# EAGLE design belamini_cape_B4 (EAGLE 9.6.0)

## Sheet 1 of 2
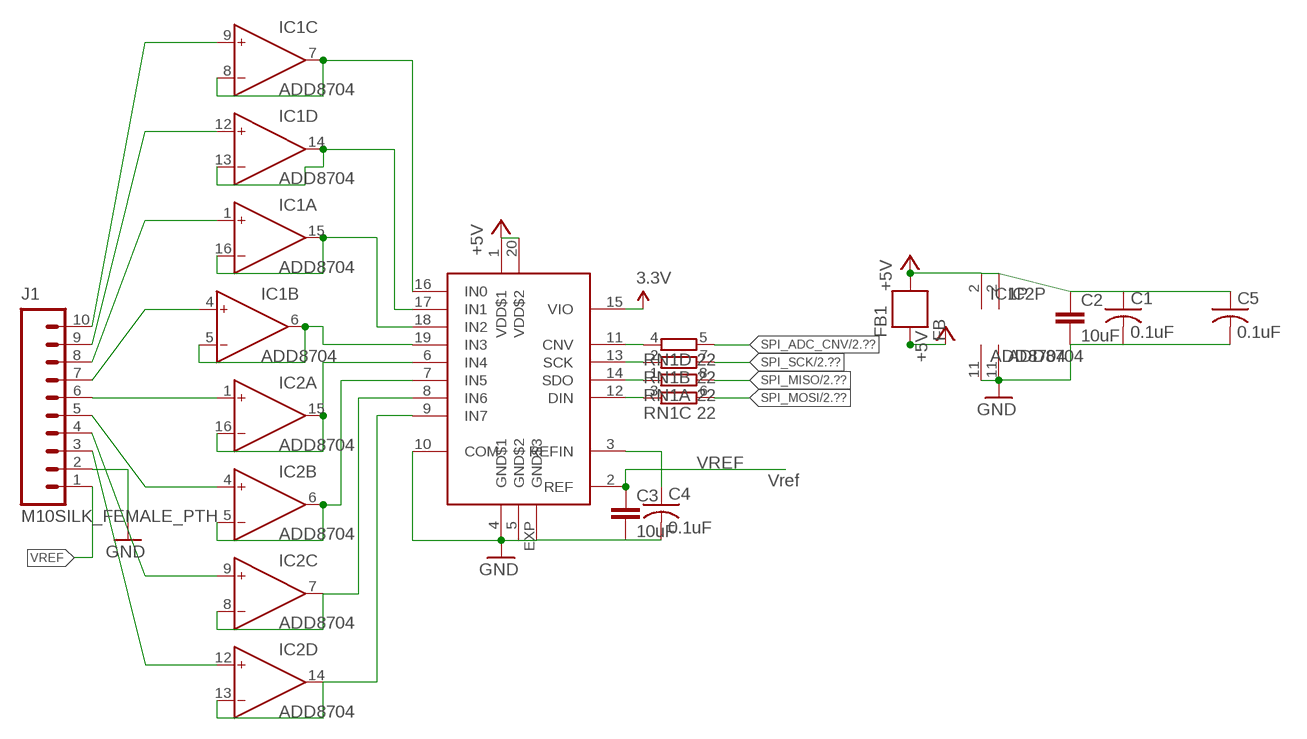
[diagram p0: schematic, sheet 1]

### Parts
C1  0.1uF  C-USC0603  [C0603]
C2  10uF  CAP0603-CAP  [0603-CAP]
C3  10uF  CAP0603-CAP  [0603-CAP]
C4  0.1uF  C-USC0603  [C0603]
C5  0.1uF  C-USC0603  [C0603]
FB1  FB  [0603]
IC1  ADD8704  [QFN16-3X3]
IC2  ADD8704  [QFN16-3X3]
IC3  AD7699  [LFCSP20-LEADS]
J1  M10SILK_FEMALE_PTH  [1X10]
RN1  22  4R-N0603-ARC  [0603-ARC]

### Nets
3.3V: IC3.15(VIO) ; also sheet 2
+5V_ADC_DAC: C1.1 C2.1 C5.1 FB1.1 IC1.2(P:V+) IC2.2(P:V+) IC3.1(VDD$1) IC3.20(VDD$2) ; supply symbol labelled +5V
+5V_SYS: FB1.2 ; supply symbol labelled +5V ; also sheet 2
GND: C1.2 C2.2 C3.2 C4.2 C5.2 IC1.11(P:V-) IC2.11(P:V-) IC3.4(GND$1) IC3.5(GND$2) IC3.10(COM) IC3.EXP(GND$3) J1.2 ; also sheet 2
N$4: IC2.1(A:IN+) J1.6
N$7: IC1.7(C:OUT) IC1.8(C:IN-) IC3.16(IN0)
N$8: IC1.13(D:IN-) IC1.14(D:OUT) IC3.17(IN1)
N$9: IC2.15(A:OUT) IC2.16(A:IN-) IC3.6(IN4)
N$10: IC2.5(B:IN-) IC2.6(B:OUT) IC3.7(IN5)
N$11: IC2.7(C:OUT) IC2.8(C:IN-) IC3.8(IN6)
N$12: IC2.13(D:IN-) IC2.14(D:OUT) IC3.9(IN7)
N$14: IC3.11(CNV) RN1.4
N$20: IC3.12(DIN) RN1.3
N$22: C4.1 IC3.3(REFIN)
N$23: IC3.13(SCK) RN1.2
N$24: IC3.14(SDO) RN1.1
N$27: IC1.5(B:IN-) IC1.6(B:OUT) IC3.19(IN3)
N$30: IC1.15(A:OUT) IC1.16(A:IN-) IC3.18(IN2)
N$37: IC1.9(C:IN+) J1.10
N$38: IC1.12(D:IN+) J1.9
N$39: IC1.1(A:IN+) J1.8
N$40: IC1.4(B:IN+) J1.7
N$42: IC2.4(B:IN+) J1.5
N$43: IC2.9(C:IN+) J1.4
N$44: IC2.12(D:IN+) J1.3
SPI_ADC_CNV: RN1.5 ; also sheet 2
SPI_MISO: RN1.8 ; also sheet 2
SPI_MOSI: RN1.6 ; also sheet 2
SPI_SCK: RN1.7 ; also sheet 2
VREF: C3.1 IC3.2(REF) J1.1

### Notes on the sheet
- Vref

## Sheet 2 of 2
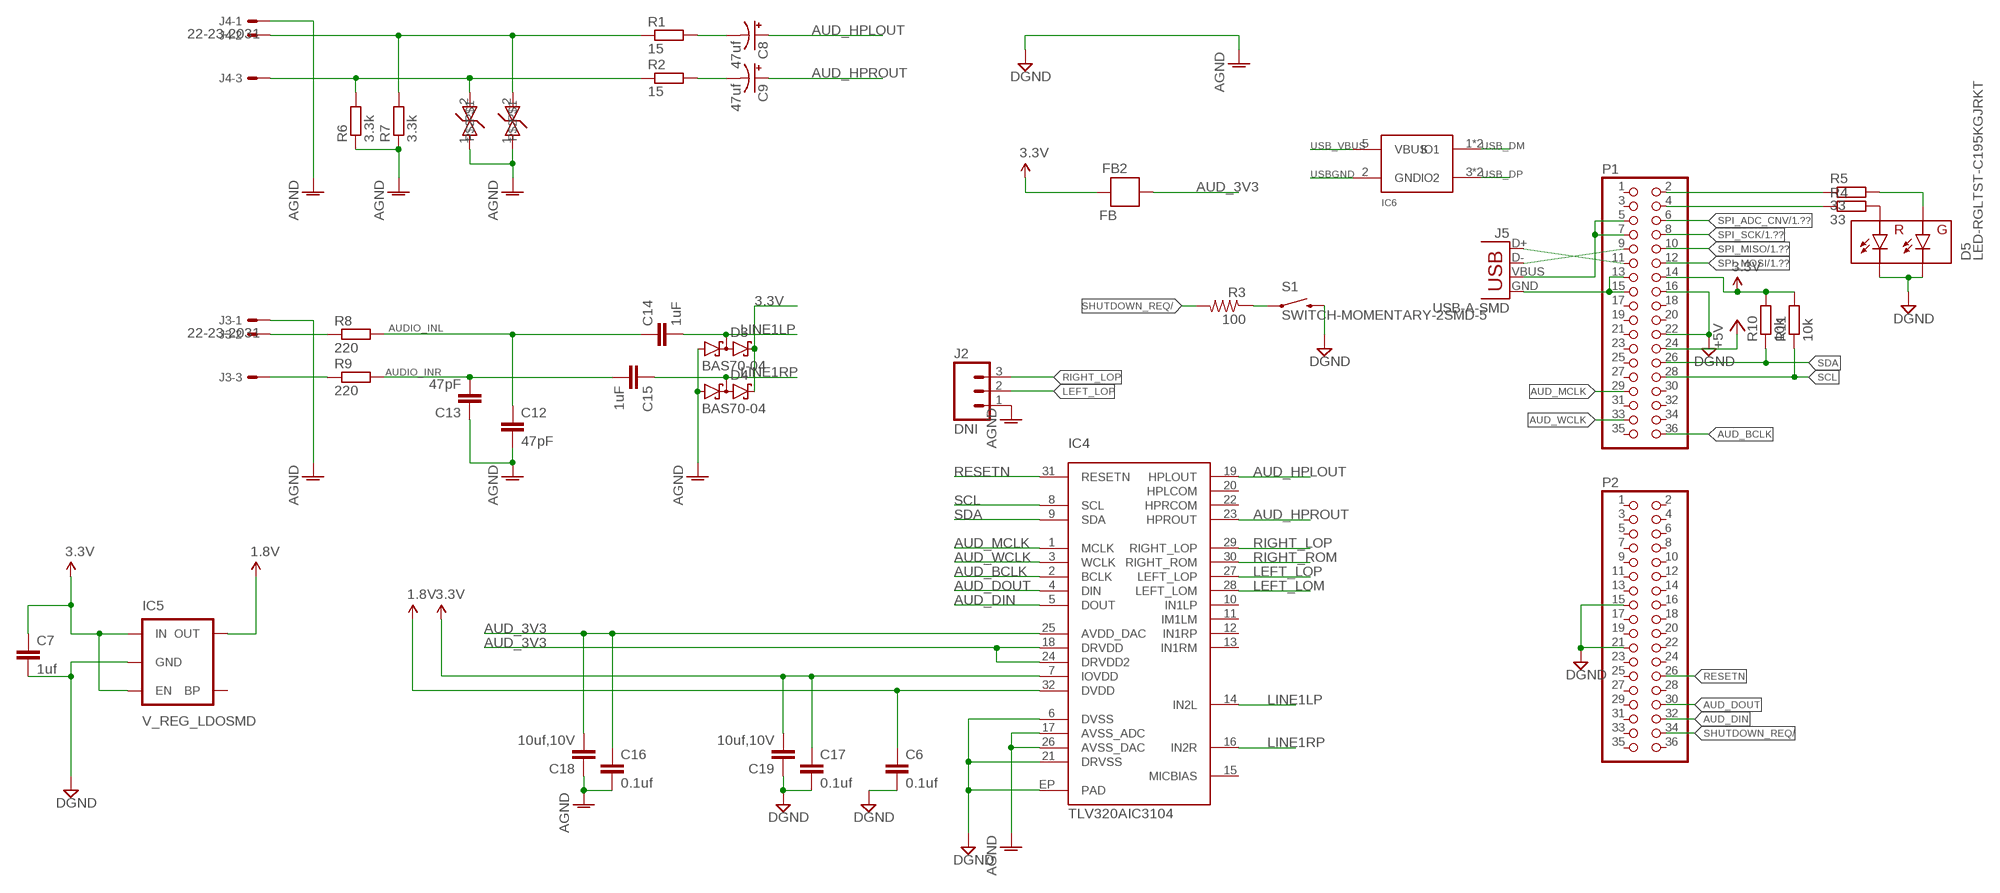
[diagram p1: schematic, sheet 2]

### Parts
C6  0.1uf  C-EUC0603  [C0603]
C7  1uf  C-EUC0603  [C0603]
C8  47uf  CAP_POL1206  [EIA3216]
C9  47uf  CAP_POL1206  [EIA3216]
C12  47pF  C-EUC0603  [C0603]
C13  47pF  C-EUC0603  [C0603]
C14  1uF  C-EUC0603  [C0603]
C15  1uF  C-EUC0603  [C0603]
C16  0.1uf  C-EUC0603  [C0603]
C17  0.1uf  C-EUC0603  [C0603]
C18  10uf,10V  CAP0603-CAP  [0603-CAP]
C19  10uf,10V  CAP0603-CAP  [0603-CAP]
D1  PGB0010603MR  [0603]
D2  PGB0010603MR  [0603]
D3  BAS70-04  [SOT23]
D4  BAS70-04  [SOT23]
D5  LED-RGLTST-C195KGJRKT  [LTST-C195KGJRKT]
FB2  FB  [0603]
IC4  TLV320AIC3104  [QFN-32]
IC5  V_REG_LDOSMD  [SOT23-5]
IC6  USBLC6-2  [SOT23-6]
J2  DNI  M03PTH  [1X03]
J3  22-23-2031  [22-23-2031]
J4  22-23-2031  [22-23-2031]
J5  USB-A-SMD  [USB-A-S-NOSILK-FEMALE]
P1  PINHD-2X18  [2X18]
P2  PINHD-2X18  [2X18]
R1  15  R-EU_R0603  [R0603]
R2  15  R-EU_R0603  [R0603]
R3  100  R-US_R0603  [R0603]
R4  33  R-EU_R0603  [R0603]
R5  33  R-EU_R0603  [R0603]
R6  3.3k  R-EU_R0603  [R0603]
R7  3.3k  R-EU_R0603  [R0603]
R8  220  R-EU_R0603  [R0603]
R9  220  R-EU_R0603  [R0603]
R10  10k  R-EU_R0603  [R0603]
R11  10k  R-EU_R0603  [R0603]
S1  SWITCH-MOMENTARY-2SMD-5  [TACTILE_SWITCH_SMD-4]

### Nets
1.8V: C6.1 IC4.32(DVDD) IC5.5(OUT)
3.3V: C7.1 C17.1 C19.2 D3.2(C2) D4.2(C2) FB2.2 IC4.7(IOVDD) IC5.1(IN) IC5.3(EN) P1.14 R10.2 R11.2 ; also sheet 1
+5V_SYS: P1.24 ; supply symbol labelled +5V ; also sheet 1
AUD_3V3: C16.1 C18.2 FB2.1 IC4.18(DRVDD) IC4.24(DRVDD2) IC4.25(AVDD_DAC)
AUD_BCLK: IC4.2(BCLK) P1.36
AUD_DIN: IC4.5(DOUT) P2.32
AUD_DOUT: IC4.4(DIN) P2.30
AUD_HPLOUT: C8.A(+) IC4.19(HPLOUT)
AUD_HPROUT: C9.A(+) IC4.23(HPROUT)
AUD_MCLK: IC4.1(MCLK) P1.29
AUD_WCLK: IC4.3(WCLK) P1.33
AUDIO_INL: C12.1 C14.1 R8.2
AUDIO_INR: C13.2 C15.2 R9.2
GND: C6.2 C7.2 C12.2 C13.1 C16.2 C17.2 C18.1 C19.1 D1.1 D2.1 D3.1(A1) D4.1(A1) D5.P$3(GC) D5.P$4(RC) IC4.6(DVSS) IC4.17(AVSS_ADC) IC4.21(DRVSS) IC4.26(AVSS_DAC) IC4.EP(PAD) IC5.2(GND) J2.1 J3.1 J4.1 P1.16 P1.22 P2.15 P2.21 R6.1 R7.1 S1.4 ; supply symbol labelled DGND, AGND ; also sheet 1
HPL: D2.2 J4.2 R1.1 R7.2
HPR: D1.2 J4.3 R2.1 R6.2
LEFT_LOM: IC4.28(LEFT_LOM)
LEFT_LOP: IC4.27(LEFT_LOP) J2.2
LINE1LP: C14.2 D3.3(C1A2) IC4.14(IN2L)
LINE1RP: C15.1 D4.3(C1A2) IC4.16(IN2R)
N$1: J3.2 R8.1
N$2: J3.3 R9.1
N$6: D5.P$2(RA) R4.2
N$13: D5.P$1(GA) R5.2
N$15: P1.4 R4.1
N$16: P1.2 R5.1
N$54: C8.C(-) R1.2
N$58: R3.1 S1.1
N$59: C9.C(-) R2.2
RESETN: IC4.31(RESETN) P2.26
RIGHT_LOP: IC4.29(RIGHT_LOP) J2.3
RIGHT_ROM: IC4.30(RIGHT_ROM)
SCL: IC4.8(SCL) P1.28 R11.1
SDA: IC4.9(SDA) P1.26 R10.1
SHUTDOWN_REQ/: P2.34 R3.2
SPI_ADC_CNV: P1.6 ; also sheet 1
SPI_MISO: P1.10 ; also sheet 1
SPI_MOSI: P1.12 ; also sheet 1
SPI_SCK: P1.8 ; also sheet 1
USB_DM: IC6.1(IO1) IC6.6(IO1) J5.D- P1.9
USB_DP: IC6.3(IO2) IC6.4(IO2) J5.D+ P1.11
USB_VBUS: IC6.5(VBUS) J5.VBUS P1.5 P1.7
USBGND: IC6.2(GND) J5.GND P1.13 P1.15
Unconnected: IC4.10(IN1LP) IC4.11(IM1LM) IC4.12(IN1RP) IC4.13(IN1RM) IC4.15(MICBIAS) IC4.20(HPLCOM) IC4.22(HPRCOM) IC5.4(BP) P1.1 P1.3 P1.17 P1.18 P1.19 P1.20 P1.21 P1.23 P1.25 P1.27 P1.30 P1.31 P1.32 P1.34 P1.35 P2.1 P2.2 P2.3 P2.4 P2.5 P2.6 P2.7 P2.8 P2.9 P2.10 P2.11 P2.12 P2.13 P2.14 P2.16 P2.17 P2.18 P2.19 P2.20 P2.22 P2.23 P2.24 P2.25 P2.27 P2.28 P2.29 P2.31 P2.33 P2.35 P2.36

### Notes on the sheet
- IC6

## Library data of the parts
C1 C4 C5 = rcl:C-US: CAPACITOR, American symbol
C2 C3 = SparkFun-Passives:CAP: Capacitor Standard 0603 ceramic capacitor, and 0.1" leaded capacitor.
C6 C16 C17 = rcl:C-EU: CAPACITOR, European symbol; MANEX: 123-0001056
C7 = rcl:C-EU: CAPACITOR, European symbol; MANEX: 123-0001087
C8 C9 = SparkFun-Capacitors:CAP_POL: Capacitor Polarized These are standard SMD and PTH capacitors. Normally 10uF, 47uF, and 100uF in electrolytic and tantalum varieties. Always verify the external diameter of the through hole cap, it varies with capacity, voltage, and manufacturer. The EIA devices should be standard.; MANEX: 123-0001196
C12 C13 = rcl:C-EU: CAPACITOR, European symbol; MANEX: 123-0001115
C14 C15 = rcl:C-EU: CAPACITOR, European symbol; MANEX: 123-0001032
C18 C19 = SparkFun-Passives:CAP: Capacitor Standard 0603 ceramic capacitor, and 0.1" leaded capacitor.; MANEX: 123-0001127
D1 D2 = CircuitCo:PGB0010603MR; MANEX: 130-0001371
D3 D4 = diode:BAS70-04: Silicon Schottky Diodes General-purpose diode for high-speed switching
D5 = SparkFun-LED:LED-RG; PROD_ID: DIO-12140
FB1 = SparkFun-Passives:FB
FB2 = SparkFun-Passives:FB; MANEX: 126-0001418
IC1 IC2 = custom:ADD8704: 16 V Quad Operational Amplifier Source: Ananlog Devices .. 780914713ADD8704_0.pdf
IC3 = custom:AD7699
IC4 = CircuitCo:TLV320AIC3104; MANEX: 140-0004277
IC5 = SparkFun-PowerIC:V_REG_LDO: Voltage Regulator LDO Standard 150mA LDO voltage regulator in SOT-23 layout. Micrel part MIC5205. BP (by-pass) pin is used to lower output noise with 470pF cap.; MANEX: 140-0001616
IC6 = custom:USBLC6-2
J1 = SparkFun-Connectors:M10: Header 10 Standard 10-pin 0.1" header. Use with straight break away headers (SKU : PRT-00116), right angle break away headers (PRT-00553), swiss pins (PRT-00743), machine pins (PRT-00117), and female headers (PRT-00115).; PROD_ID: CONN-11563
J2 = SparkFun-Connectors:M03: Header 3 Standard 3-pin 0.1" header. Use with straight break away headers (SKU : PRT-00116), right angle break away headers (PRT-00553), swiss pins (PRT-00743), machine pins (PRT-00117), and female headers (PRT-00115). Molex polarized connector foot print use with SKU : PRT-08232 with associated crimp pins and housings.
J3 J4 = con-molex:22-23-2031: .100" (2.54mm) Center Header - 3 Pin; MF: MOLEX; MPN: 22-23-2031; OC_FARNELL: 1462950; OC_NEWARK: 30C0862
J5 = SparkFun-Connectors:USB: USB Connectors USB-B-PTH is fully proven SKU : PRT-00139/CONN-08278 USB-miniB is fully proven SKU : PRT-00587 USB-A-PCB is untested. USB-A-H is throughly reviewed, but untested. Spark Fun Electronics SKU : PRT-00437 USB-B-SMT is throughly reviewed, but untested. Needs silkscreen touching up. USB-A-S has not been used/tested USB-MB-H has not been used/tested USB-MICROB has been used. CONN-09505; PROD_ID: CONN-09520
P1 P2 = pinhead:PINHD-2X18: PIN HEADER
R1 R2 R4-R11 = rcl:R-EU_: RESISTOR, European symbol; MANEX: 110-0002014
R3 = rcl:R-US_: RESISTOR, American symbol
RN1 = resistor-dil:4R-N: Array Chip Resistor Source: RS Component / Phycomp; OC_FARNELL: unknown; OC_NEWARK: unknown
S1 = custom:SWITCH-MOMENTARY-2: Various NO switches- pushbuttons, reed, etc

## Board
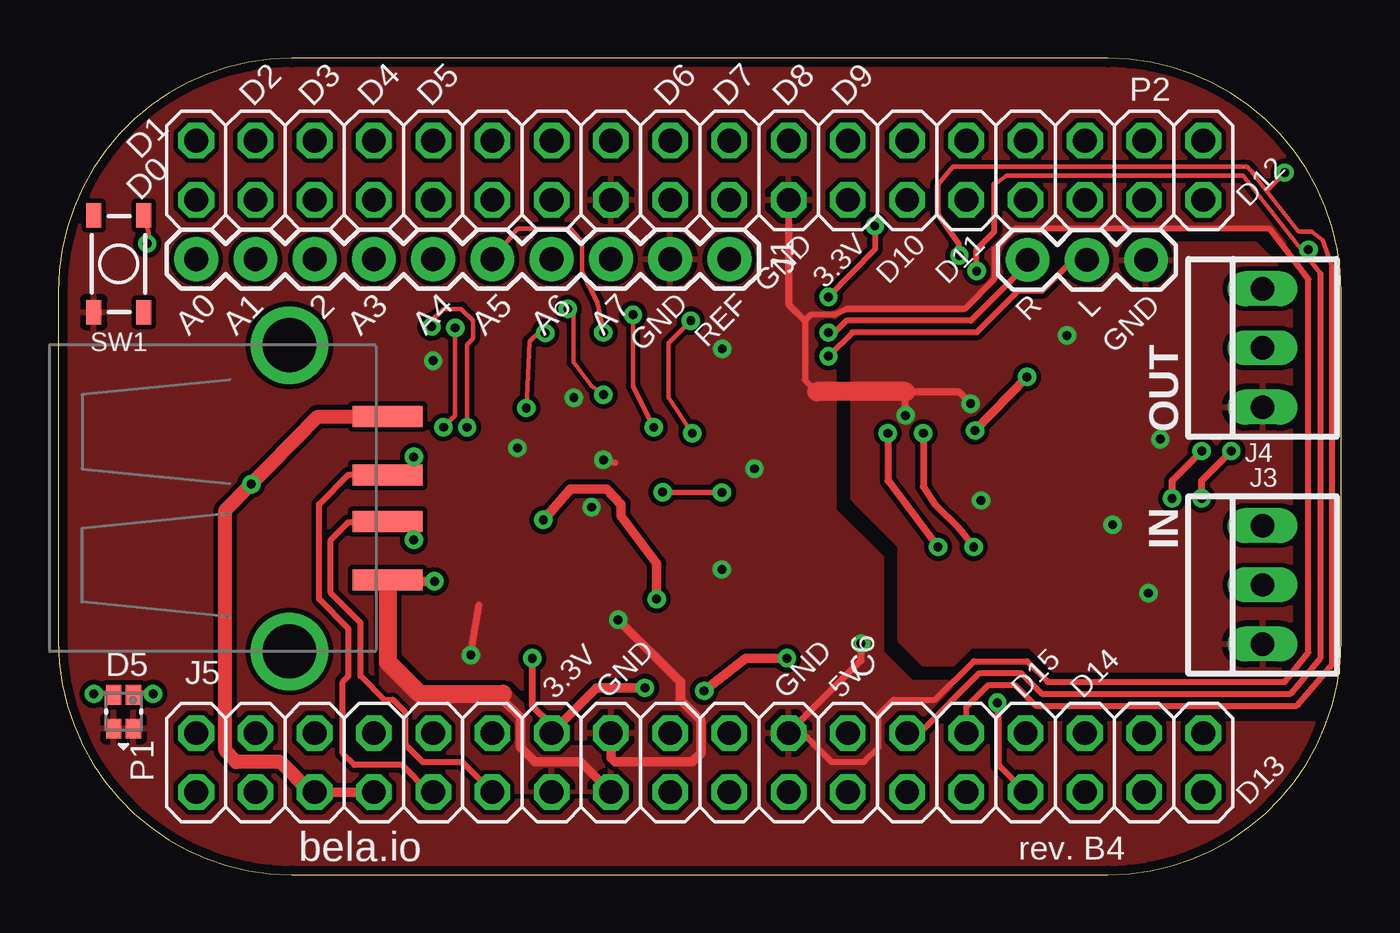
[diagram p2: board, top side]
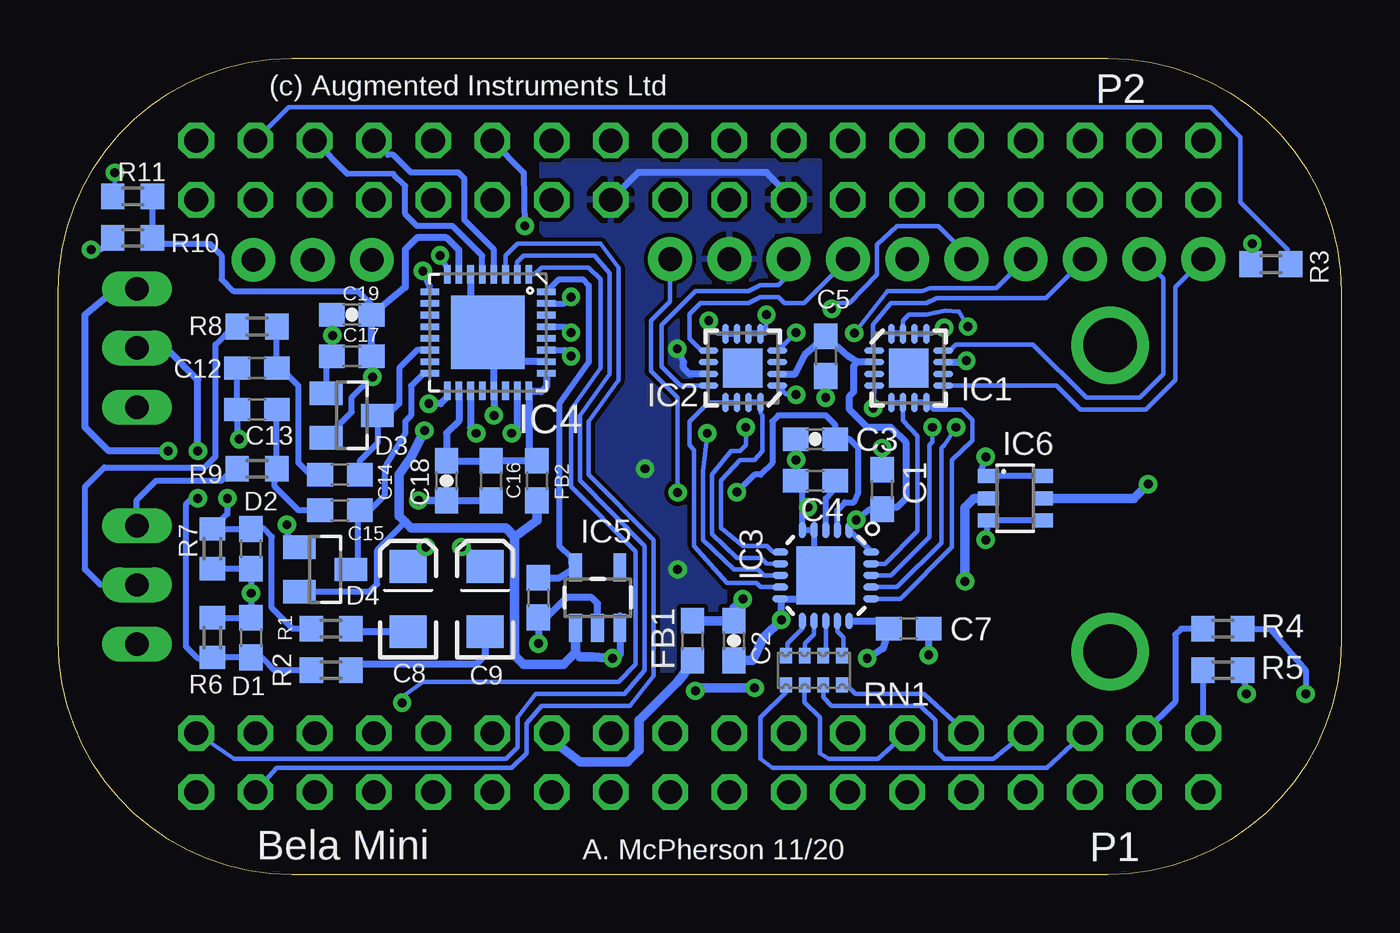
[diagram p3: board, bottom side, seen from below]

Size 55 x 35 mm. Coordinates in mm from the lower left corner, seen from the top.
Outline: 45,35 10,35 arc90 0,25 0,10 arc90 10,0 45,0 arc90 55,10 55,25 arc90 45,35
Copper layers (1*16): Top 0.035mm / dielectric 1.5mm / Bottom 0.035mm
Design rules "default *": minimum track width 8mil, minimum drill 15mil, track to track 7mil, track to pad 7mil, pad to pad 7mil, via to via 7mil, smd to smd 0mil, copper to edge 15mil, drill to drill 8mil, minimum pad ring 10mil, minimum via ring 8mil, stop-mask expansion 4mil, vias tented up to drill 20mil, thermal gap 10mil

### Footprints (pad centres in the part's own frame; a part is rotated, then mirrored left to right if it is on the bottom)
C0603 = smd 1.1 x 1: 1 -0.85,0; 2 0.85,0
0603-CAP = smd 1.1 x 1: 1 -0.85,0; 2 0.85,0
EIA3216 = smd 1.4 x 1.6: A 1.4,0; C -1.4,0
0603 = smd 1.1 x 1: 1 -0.85,0; 2 0.85,0
SOT23 = smd 1 x 1.4: 1 -0.95,-1.1; 2 0.95,-1.1; 3 0,1.1
LTST-C195KGJRKT = smd 0.65 x 0.85: P$1 0.425,0.725; P$2 -0.425,0.725; P$3 0.425,-0.725; P$4 -0.425,-0.725
QFN16-3X3 = smd 0.85 x 0.28: 1 -1.475,0.75; 2 -1.475,0.25; 3 -1.475,-0.25; 4 -1.475,-0.75; 9 1.475,-0.75; 10 1.475,-0.25; 11 1.475,0.25; 12 1.475,0.75 | smd 0.28 x 0.85: 5 -0.75,-1.475; 6 -0.25,-1.475; 7 0.25,-1.475; 8 0.75,-1.475; 13 0.75,1.475; 14 0.25,1.475; 15 -0.25,1.475; 16 -0.75,1.475 | smd 1.68 x 1.68: EXT 0,0
LFCSP20-LEADS = smd 0.7 x 0.3: 1 -1.95,1; 2 -1.95,0.5; 3 -1.95,0; 4 -1.95,-0.5; 5 -1.95,-1; 11 1.95,-1; 12 1.95,-0.5; 13 1.95,0; 14 1.95,0.5; 15 1.95,1 | smd 0.3 x 0.7: 6 -1,-1.95; 7 -0.5,-1.95; 8 0,-1.95; 9 0.5,-1.95; 10 1,-1.95; 16 1,1.95; 17 0.5,1.95; 18 0,1.95; 19 -0.5,1.95; 20 -1,1.95 | smd 2.5 x 2.5: EXP 0,0
QFN-32 = smd 0.285 x 0.8: 1 -1.75,-2.5; 2 -1.25,-2.5; 3 -0.75,-2.5; 4 -0.25,-2.5; 5 0.25,-2.5; 6 0.75,-2.5; 7 1.25,-2.5; 8 1.75,-2.5; 17 1.75,2.5; 18 1.25,2.5; 19 0.75,2.5; 20 0.25,2.5; 21 -0.25,2.5; 22 -0.75,2.5; 23 -1.25,2.5; 24 -1.75,2.5 | smd 0.8 x 0.285: 9 2.5,-1.75; 10 2.5,-1.25; 11 2.5,-0.75; 12 2.5,-0.25; 13 2.5,0.25; 14 2.5,0.75; 15 2.5,1.25; 16 2.5,1.75; 25 -2.5,1.75; 26 -2.5,1.25; 27 -2.5,0.75; 28 -2.5,0.25; 29 -2.5,-0.25; 30 -2.5,-0.75; 31 -2.5,-1.25; 32 -2.5,-1.75 | smd 3.15 x 3.15: EP 0,0
SOT23-5 = smd 0.55 x 1.2: 1 -0.95,-1.3; 2 0,-1.3; 3 0.95,-1.3; 4 0.95,1.3; 5 -0.95,1.3
SOT23-6 = smd 0.6 x 0.9: 1 -0.95,-1.15; 2 0,-1.15; 3 0.95,-1.15; 4 0.95,1.15; 5 0,1.15; 6 -0.95,1.15
1X10 = drill 1.016 pad 1.88: 1 0,0; 2 2.54,0; 3 5.08,0; 4 7.62,0; 5 10.16,0; 6 12.7,0; 7 15.24,0; 8 17.78,0; 9 20.32,0; 10 22.86,0
1X03 = drill 1.016 pad 1.88: 1 0,0; 2 2.54,0; 3 5.08,0
22-23-2031 = drill 1 long: 1 -2.54,0; 2 0,0; 3 2.54,0
USB-A-S-NOSILK-FEMALE = smd 3 x 0.9: D+ 4.212,-1; D- 4.212,1; GND 4.212,-3.5; VBUS 4.212,3.5 | drill 2.311: S1 0,-6.566; S2 0,6.566
2X18 = drill 1.016 octagon: 1 -21.59,-1.27; 2 -21.59,1.27; 3 -19.05,-1.27; 4 -19.05,1.27; 5 -16.51,-1.27; 6 -16.51,1.27; 7 -13.97,-1.27; 8 -13.97,1.27; 9 -11.43,-1.27; 10 -11.43,1.27; 11 -8.89,-1.27; 12 -8.89,1.27; 13 -6.35,-1.27; 14 -6.35,1.27; 15 -3.81,-1.27; 16 -3.81,1.27; 17 -1.27,-1.27; 18 -1.27,1.27; 19 1.27,-1.27; 20 1.27,1.27; 21 3.81,-1.27; 22 3.81,1.27; 23 6.35,-1.27; 24 6.35,1.27; 25 8.89,-1.27; 26 8.89,1.27; 27 11.43,-1.27; 28 11.43,1.27; 29 13.97,-1.27; 30 13.97,1.27; 31 16.51,-1.27; 32 16.51,1.27; 33 19.05,-1.27; 34 19.05,1.27; 35 21.59,-1.27; 36 21.59,1.27
R0603 = smd 1 x 1.1: 1 -0.85,0; 2 0.85,0
0603-ARC = smd 0.5 x 0.65: 1 -1.2,-0.625; 2 -0.4,-0.625; 3 0.4,-0.625; 4 1.2,-0.625; 5 1.2,0.625; 6 0.4,0.625; 7 -0.4,0.625; 8 -1.2,0.625
TACTILE_SWITCH_SMD-4 = smd 1.05 x 0.65: 1 -2.075,1.075; 2 2.075,1.075; 3 -2.075,-1.075; 4 2.075,-1.075

### Placement (x,y rotation side)
C1  19.69,16.51 90 bottom
C2  26.04,10.03 270 bottom
C3  22.54,18.67 180 bottom
C4  22.54,16.89 180 bottom
C5  22.1,22.22 270 bottom
C6  34.42,11.87 270 bottom
C7  18.54,10.54 0 bottom
C8  40.01,11.81 90 bottom
C9  36.7,11.81 90 bottom
C12  46.48,21.72 180 bottom
C13  46.48,19.94 0 bottom
C14  42.93,17.14 0 bottom
C15  42.93,15.62 180 bottom
C16  36.45,16.89 270 bottom
C17  42.42,22.22 180 bottom
C18  38.35,16.89 90 bottom
C19  42.42,24 0 bottom
D1  46.74,10.16 270 bottom
D2  46.74,13.97 90 bottom
D3  42.42,19.68 270 bottom
D4  43.56,13.08 270 bottom
D5  2.79,6.99 0 top
FB1  27.81,10.03 270 bottom
FB2  34.48,16.89 270 bottom
IC1  18.54,21.72 0 bottom
IC2  25.65,21.72 180 bottom
IC3  22.1,12.83 270 bottom
IC4  36.58,23.24 180 bottom
IC5  31.88,11.87 0 bottom
IC6  13.97,16.13 270 bottom
J1  28.77,26.39 180 top
J2  46.63,26.36 180 top
J3  51.63,12.42 90 top
J4  51.63,22.58 90 top
J5  9.91,16.13 0 top
P1  27.5,4.8 0 top
P2  27.5,30.2 0 top
R1  43.31,10.54 0 bottom
R2  43.31,8.76 0 bottom
R3  3.02,26.18 0 bottom
R4  5.08,10.54 0 bottom
R5  5.08,8.76 0 bottom
R6  48.39,10.16 270 bottom
R7  48.39,13.97 90 bottom
R8  46.48,23.5 0 bottom
R9  46.48,17.4 0 bottom
R10  51.82,27.3 0 bottom
R11  51.82,29.08 0 bottom
RN1  22.61,8.76 180 bottom
S1  2.59,26.19 270 top

### Tracks (layer width: path | path; a pad name or v marks a point on that pad's centre or on a via)
1.8V
  Bottom 0.254: IC4.32 33.53,25.53 32.51,25.53 32.26,25.27 32.26,21.97 33.53,20.19 33.53,14.1 33.02,13.59 33.02,13.37 IC5.5
  Bottom 0.305: 32.77,13.24 IC5.5 33.53,12.72 C6.1
3.3V  (via drill 0.38)
  Top 0.305: v20.32,9.27 20.32,7.24 21.15,6.41 P1.14
  Top 0.406: v39.3,19.04 v41.53,21.34 | v31.24,9.27 29.46,9.27 v27.69,7.87 | v25.15,8 23.08,8 P1.14
  Bottom 0.254: 40.13,15.11 41.33,13.92 41.33,12.46 41.65,12.13 D4.2 | D3.2 42.42,19.84 42.42,20.45 v41.53,21.34 | 41.5,24.06 41.5,24.35 42.16,25.02 47.5,25.02 48.01,25.53 48.01,26.54 48.51,27.05 50.71,27.05 R10.2 R11.2
  Bottom 0.305: C17.1 C19.2 | C17.1 41.4,21.97 | 41.66,23.84 C19.2 | 30.93,11.11 IC5.3 30.93,9.4 31.37,9.4 v31.24,9.27 | IC4.7 37.83,26.78 38.35,27.3 39.62,27.3 40.13,26.8 40.13,25.18 41.5,24.06 C19.2 | v41.53,21.34 41.53,22.19 C17.1 | IC3.15 19.73,10.88 C7.1 19.65,9.69 v20.32,9.27
  Bottom 0.406: IC5.1 32.83,9.52 | 32.83,9.52 32.64,9.33 32.07,9.33 v31.24,9.27 | FB2.2 34.48,15.18 35.43,14.48 | 35.43,14.48 35.43,9.4 35.05,9.02 33.33,9.02 32.83,9.52 | 35.43,14.48 35.81,14.86 39.88,14.86 40.13,15.11 40.39,15.37 40.39,17.14 39.88,17.91 v39.3,19.04 | v27.69,7.87 27.43,8 v25.15,8
+5V_ADC_DAC  (via drill 0.38)
  Top 0.406: v25.65,11.81 25.65,13.34 24.13,15.37 24.13,15.88 23.5,16.54 21.97,16.54 v20.8,15.21
  Bottom 0.254: IC3.20 IC3.1 v20.8,15.21 20.21,15.66 C1.1
  Bottom 0.305: IC2.2 23.4,21.47 22.99,22.29 C5.1 21.14,22.23 20.74,21.97 | IC1.2 20.74,21.97 | 20.74,21.97 20.89,21.82 20.89,20.7 21.08,20.51 21.08,19.94 20.32,19.18 19.3,19.18 18.67,18.54 18.67,16.13 19.05,15.75 19.6,15.75 C1.1
  Bottom 0.406: FB1.1 C2.1 26.04,11.43 v25.65,11.81
+5V_SYS
  Bottom 0.406: P1.24 33.85,5.78 32.64,4.83 30.61,4.83 30.1,5.33 30.1,6.6 28.45,8.25 28.23,8.51 FB1.2
AUD_3V3
  Bottom 0.305: IC4.25 34.08,20.91 34.29,20.7 34.79,20.7 IC4.24 34.83,18.09 FB2.1 C16.1 C18.2 38.35,18.92 37.83,19.45 IC4.18
AUD_BCLK
  Bottom 0.203: IC4.2 35.33,26.27 35.05,26.54 32,26.54 31.37,25.78 31.37,21.46 32.64,19.68 32.64,16.89 29.87,14.1 29.87,8.76 30.73,7.75 34.54,7.75 35.31,6.73 35.31,5.46 35.81,4.95 47.47,4.95 P1.36
AUD_DIN
  Bottom 0.254: IC4.5 36.83,26.54 38.1,27.81 39.62,27.81 40.13,28.32 40.13,29.53 40.64,30.04 42.62,30.05 P2.32
AUD_DOUT
  Bottom 0.254: IC4.4 36.33,26.8 37.59,28.07 37.59,29.85 37.85,30.1 39.88,30.1 40.64,30.86 40.86,30.86 P2.30
AUD_HPLOUT  (via drill 0.38)
  Top 0.305: v37.08,18.92 37.08,16.64 37.59,15.88 38.61,14.86 v39.24,14.05
  Bottom 0.305: IC4.19 37.33,19.16 v37.08,18.92 | v39.24,14.05 40.13,13.34 C8.A
AUD_HPROUT  (via drill 0.38)
  Top 0.305: v35.56,18.92 35.56,16.89 v37.72,14.05
  Bottom 0.305: IC4.23 35.33,19.16 v35.56,18.92 | v37.72,14.05 36.58,13.34 C9.A
AUD_MCLK  (via drill 0.38)
  Top 0.254: P1.29 40.3,4.7
  Top 0.305: 40.3,4.7 40.3,6.82 v40.26,7.37
  Bottom 0.203: IC4.1 34.58,25.74 34.29,26.04 32.26,26.04 31.75,25.53 31.75,21.72 33.02,19.94 33.02,16.64 30.25,13.84 30.25,9.02 30.99,8.25 39.37,8.25 40.26,7.62
  Bottom 0.254: 40.26,7.62 v40.26,7.37
AUD_WCLK
  Bottom 0.203: IC4.3 35.83,26.53 35.31,27.05 31.75,27.05 30.99,26.04 30.99,21.21 32.26,19.43 32.26,17.14 29.49,14.35 29.49,8.51 30.48,7.24 34.29,7.24 34.93,6.48 34.93,5.21 35.56,4.57 45.63,4.57 P1.33
AUDIO_INL
  Bottom 0.254: 44.11,17.14 C14.1 44.2,17.14 44.7,17.65 44.7,20.95 45.47,21.72 C12.1 R8.2
AUDIO_INR
  Bottom 0.254: C15.2 44.7,15.62 45.72,16.64 45.72,17.31 R9.2 C13.2
GND  (via drill 0.38, 0.38 pad 0.41)
  Top 0.254: P1.22 31.9,6.07 33.15,4.83 34.54,4.83 35.18,5.46 35.18,6.86 35.81,7.49 37.59,7.49 39.24,9.14 41.53,9.14 42.42,8.25 52.58,8.25 53.59,9.52 53.59,25.53 51.94,27.69 41.02,27.69 40.13,26.8 40.13,25.53 38.86,24.26 33.78,24.26 33.27,24 32.26,24 32,23.75 32,21.21 32.51,20.7 | v19.69,18.29 19.94,18.29 | v23.37,17.78 23.88,17.65
  Top 0.305: v39.12,20.19 38.61,20.7 36.32,20.7 v36.32,19.68 | v34.42,9.91 34.42,9.18 P1.22 | v17.68,9.41 18.03,11.56 | v28.46,22.54 28.45,22.73 | P2.21 31.31,24.44 32,23.75
  Top 0.406: P1.16 23.69,5.01 23.88,4.83 27.18,4.83 27.56,5.21 27.56,6.6 26.67,7.49 26.67,8.25 v24,10.92
  Top 0.813: 36.32,20.7 32.51,20.7
  Bottom 0.254: IC3.EXP 22.6,13.33 IC3.4 IC3.5 23.1,16.13 | 23.1,16.13 23.1,16.85 C4.2 C3.2 23.34,18.39 v23.37,17.78 | C1.2 v19.69,18.29 | v22.86,15.75 23.11,16.11 23.1,16.13 | R7.1 D2.1 v46.74,12.07 D1.1 R6.1 | C12.2 C13.1 47.33,18.76 v47.24,18.67 | C17.2 43.52,21.97 D3.1 | D4.1 45.17,14.54 45.17,14.97 v45.2,15
  Bottom 0.305: IC4.6 37.33,23.99 IC4.EP 36.33,22.99 36.33,22.22 | 36.33,22.22 IC4.21 v36.33,19.69 v36.32,19.68 | IC5.2 31.88,11.62 32.13,11.88 33.21,11.88 34.06,11.02 C6.2 v34.42,9.91 | C19.1 C17.2 43.27,22.64 v43.24,23.11 | IC1.11 16.26,21.97 v16.07,22.03 | IC2.11 27.94,21.47 28.19,21.72 28.19,21.97 v28.46,22.54 | C5.2 v22.1,20.45 | IC3.EXP 23.1,11.83 IC3.10 24,11.78 v24,10.92 | C18.1 v39.56,16.04 C16.2 | IC4.17 38.33,20.47 38.61,20.19 v39.12,20.19 | P2.15 23.69,29.15 24.64,30.1 30.14,30.1 P2.21 | IC4.26 36.09,21.99 36.33,22.22 | C7.2 17.69,10.14 v17.68,9.41
  Bottom 0.406: C2.2 25.23,9.18 24.77,10.16 v24,10.92
  other vias: 29.85,17.4 28.45,13.08
  pour Top (isolate 0.203): 34.04,23.24 38.86,23.24 42.42,26.8 42.67,27.05 51.31,27.05 52.83,25.53 52.83,9.27 52.32,8.76 42.67,8.76 41.91,9.52 41.66,9.78 39.12,9.78 38.35,9.02 37.08,9.02 36.07,10.03 36.07,14.1 34.29,15.88 34.04,16.13
  pour Top (isolate 0.203, rank 2): 38.35,23.75 42.29,27.69 51.94,27.69 52.58,27.05 54.86,27.05 54.86,34.93 0,34.93 0,-0.13 54.1,0.13 54.1,6.48 39.88,6.48 38.1,8.25 36.58,8.25 35.31,9.52 35.31,13.59 33.27,15.62 33.27,22.99 34.04,23.75
  pour Bottom: 28.57,8.76 29.72,8.76 29.72,14.35 32.51,17.14 32.51,19.68 30.99,21.21 30.99,24.26 34.29,27.56 34.29,30.61 22.35,30.61 22.35,27.56 24.38,27.56 24.38,25.02 28.45,24.51 28.45,21.97 27.18,20.7 27.18,13.34 26.42,12.57 26.42,11.05 28.57,11.05
HPL  (via drill 0.38)
  Top 0.305: v47.75,16.13 47.75,16.89 v49.02,18.16
  Bottom 0.254: v47.75,16.13 47.75,15.45 R7.2 D2.2 46.7,14.86 46.23,14.86 45.85,14.48 45.85,11.43 44.96,10.54 R1.1
  Bottom 0.305: D2.2 46.74,14.86 | v49.02,18.16 49.02,21.21 50.29,22.48 51.53,22.48 J4.2
HPR  (via drill 0.38)
  Top 0.305: v49.02,16.13 49.02,16.89 v50.29,18.16
  Bottom 0.254: v49.02,16.13 49.28,16.13 49.53,15.88 49.53,9.78 49.02,9.27 48.43,9.27 R6.2 D1.2 46.27,9.31 45.72,8.76 R2.1
  Bottom 0.305: v50.29,18.16 52.83,18.16 53.85,19.18 53.85,24 52.32,25.27 51.78,25.27 J4.3
LEFT_LOP  (via drill 0.38)
  Top 0.254: J2.2 43.5,26.36 42.16,25.02 41.15,25.02 39.37,23.24 34.04,23.24 v33.02,22.22
  Bottom 0.254: IC4.27 33.26,22.49 v33.02,22.22
LINE1LP
  Bottom 0.254: IC4.14 39.61,22.49 40.39,21.72 40.39,20.19 40.89,19.68 D3.3 41.32,18.5 42.08,17.74 C14.2
LINE1RP
  Bottom 0.254: IC4.16 39.34,21.49 39.88,20.95 39.88,19.68 40.13,19.43 40.13,18.92 40.89,17.65 41.02,17.4 41.02,16.26 41.66,15.62 C15.1 42.16,15.53 42.16,13.38 D4.3
N$1
  Bottom 0.254: J3.2 53.19,12.42 53.85,13.08 53.85,16.64 53.02,17.46 48.73,17.46 48.26,17.93 48.26,22.73 47.5,23.5 R8.1
N$2
  Bottom 0.254: J3.3 51.63,16.06 50.8,16.89 48.01,16.89 47.5,17.4 R9.1
N$4  (via drill 0.38)
  Top 0.203: v21.84,24.26 22.1,24 22.1,21.97 22.86,20.95 v23.37,20.57
  Bottom 0.203: J1.6 16.07,26.61 17.27,27.81 19.05,27.81 19.91,27 19.91,25.73 21.08,24.51 21.59,24.51 v21.84,24.26 | v23.37,20.57 23.79,20.57 IC2.1
N$6  (via drill 0.38)
  Top 0.254: v1.52,7.75 2.29,7.79 D5.P$2
  Bottom 0.254: R4.2 3.05,10.54 1.52,8.76 v1.52,7.75
N$7
  Bottom 0.203: IC1.8 17.49,19.94 16.26,19.94 15.81,19.49 15.81,18.61 16.69,17.78 16.69,14.05 18.91,11.83 IC3.16
  Bottom 0.254: IC1.8 IC1.7
N$8  (via drill 0.38)
  Top 0.203: v17.02,23.44 17.02,19.68 v16.51,19.18
  Bottom 0.203: IC1.13 17.57,23.19 v17.02,23.44 | v16.51,19.18 17.02,18.41 17.14,18.29 17.14,14.22 19.04,12.33 IC3.17
  Bottom 0.254: IC1.14 IC1.13
N$9
  Bottom 0.203: IC2.15 24.94,20.24 24.89,20.19 24.89,19.81 24.82,19.68 24.82,18.16 25.15,17.78 25.78,17.78 26.59,16.89 26.59,14.86 25.64,14.08 24.62,14.08 24.38,13.84 IC3.6
  Bottom 0.254: IC2.16 IC2.15
N$10  (via drill 0.38)
  Top 0.203: v24.64,24 24.64,20.95 v25.53,19.18
  Bottom 0.203: IC2.6 24.69,23.19 v24.64,24 | v25.53,19.18 25.53,18.41 25.78,18.16 26.16,18.16 26.98,17.14 26.98,14.61 25.9,13.58 24.88,13.58 24.64,13.34 IC3.7
  Bottom 0.254: IC2.5 IC2.6
N$11  (via drill 0.38)
  Top 0.203: v27.18,18.92 26.16,20.45 26.16,22.8 v27.11,23.75
  Bottom 0.203: IC2.8 26.75,23.19 v27.11,23.75 | IC3.8 24.74,12.83 24.99,13.08 26.04,13.08 27.36,14.35 27.36,17.27 v27.18,18.92
  Bottom 0.254: IC2.8 IC2.7
N$12
  Bottom 0.203: 26.42,20.07 26.42,20.23 IC2.13 27.13,20.24 27.94,19.43 27.94,18.41 27.74,18.21 27.74,14.1 26.34,12.5 25.07,12.5 24.9,12.33 IC3.9
  Bottom 0.254: IC2.13 IC2.14
N$13  (via drill 0.38)
  Top 0.254: v4.06,7.75 3.3,7.79 D5.P$1
  Bottom 0.254: R5.2 v4.06,7.75
N$14
  Bottom 0.203: IC3.11 23.1,10.56 23.75,9.91 23.75,9.45 RN1.4
N$15
  Bottom 0.254: R4.1 6.86,10.54 7.11,10.29 7.11,7.41 P1.4
N$16
  Bottom 0.254: R5.1 5.93,6.09 P1.2
N$20
  Bottom 0.203: RN1.3 22.99,9.91 22.6,10.3 IC3.12
N$22
  Bottom 0.254: IC3.3 22.1,16.13 21.84,16.38 21.84,16.99 C4.1
N$23
  Bottom 0.203: IC3.13 22.1,9.53 RN1.2
N$24
  Bottom 0.203: IC3.14 21.6,10.42 21.34,10.16 21.34,9.52 21.46,9.45 RN1.1
N$27
  Bottom 0.203: IC1.6 18.8,19.48 18.16,18.8 18.16,14.73 19.57,13.33 IC3.19
  Bottom 0.254: IC1.5 IC1.6
N$30  (via drill 0.38)
  Top 0.203: v16,23.5 16,23.75 16.51,24.26 17.27,24.26 17.78,23.75 17.78,22.99 17.53,22.73 v17.53,19.18
  Bottom 0.203: IC1.15 18.79,23.75 18.54,24 17.78,24 16.97,24.19 16.38,24.13 v16,23.5 | v17.53,19.18 17.53,18.54 17.65,18.41 17.65,14.48 19.3,12.83 IC3.18
  Bottom 0.254: IC1.15 IC1.16
N$37
  Bottom 0.203: IC1.9 12.2,20.97 11.18,19.94 8.38,19.94 7.11,21.21 7.11,25.19 J1.10
N$38
  Bottom 0.203: IC1.12 16.78,22.47 16.51,22.73 13.21,22.73 10.92,20.45 8.64,20.45 7.62,21.46 7.62,25.56 J1.9
N$39
  Bottom 0.203: J1.8 12.67,24.71 17.32,24.71 17.78,24.51 19.3,24.51 20.07,23.58 20.07,22.52 IC1.1
N$40  (via drill 0.38)
  Top 0.203: v20.07,20 20.19,22.86 20.72,23.34 v20.87,23.22
  Bottom 0.203: IC1.4 20.02,20.75 v20.07,20 | v20.87,23.22 19.46,25.02 17.98,25.02 17.61,25.14 14.78,25.14 J1.7
N$42  (via drill 0.38)
  Top 0.203: J1.5 18.64,26.39 19.69,27.69 21.97,27.69 22.45,27.13 22.45,25.86 23.11,24.51 v23.37,23.24
  Bottom 0.203: IC2.4 24.14,22.47 v23.37,23.24
N$43
  Bottom 0.203: IC2.9 27.42,22.47 27.94,22.99 27.94,24.04 27.59,24.39 27.58,24.39 27.47,24.5 25.41,24.5 24.89,24.77 24.13,24.77 23.88,24.51 23.04,24.5 J1.4
N$44
  Bottom 0.203: IC2.12 28.33,20.97 29.15,21.78 29.15,23.56 27.69,25.02 25.4,25.02 24.89,25.27 24.13,25.27 23.69,25.71 J1.3
N$54
  Bottom 0.254: 42.33,10.41 R1.2
  Bottom 0.305: 40.01,10.45 C8.C 42.33,10.41
N$58  (via drill 0.38)
  Top 0.203: S1.1 3.87,27.5 v3.81,27.05
  Bottom 0.254: R3.1 3.87,26.99 v3.81,27.05
N$59
  Bottom 0.254: 42.2,9.02 R2.2
  Bottom 0.305: C9.C 36.7,9.4 37.08,9.02 41.15,9.02 42.2,9.02
RESETN  (via drill 0.38)
  Top 0.254: v35,27.81 35,26.8 v33.02,24.77
  Bottom 0.254: IC4.31 33.29,24.49 v33.02,24.77 | P2.26 36.39,31.44 35.05,30.1 v35,27.81
RIGHT_LOP  (via drill 0.38)
  Top 0.254: J2.3 41.05,25.68 39.12,23.75 33.78,23.75 33.27,23.24 v33.02,23.24
  Bottom 0.254: IC4.29 33.27,23.49 v33.02,23.24
SCL  (via drill 0.38)  (1 unrouted)
  Top 0.203: 37.72,29.59 38.35,30.35 50.81,30.35 | 54.61,26.04 54.22,27.21 53.74,27.56 53.2,27.56 53.15,27.61 51.8,29.32 | 51.8,29.32 51.18,30.1 51.18,30.13 51.09,30.22 51,30.33 50.98,30.33 50.96,30.35 50.82,30.35 50.8,30.36 | v52.58,30.1 51.8,29.32
  Top 0.254: v38.63,26.54 38.61,27.05 37.72,28.32 37.72,29.59 | 54.61,26.04 54.61,9.02 53.09,7.24 41.91,7.24 41.02,8.13 39.88,8.13 38.93,7.18 P1.28
  Bottom 0.203: IC4.8 | R11.1 52.58,29.17 v52.58,30.1
  Bottom 0.254: IC4.8 38.33,26.01 v38.63,26.54
SDA  (via drill 0.38)
  Top 0.203: 40.13,29.59 40.64,29.97 50.8,29.97 53.32,26.78 54.1,25.78
  Top 0.254: v39.37,25.88 39.37,26.8 40.13,27.56 40.13,29.59 | 54.1,25.78 54.1,9.27 52.83,7.75 42.16,7.75 41.27,8.64 39.5,8.64 36.93,6.07 P1.26 | v53.59,26.8 53.58,26.78 53.32,26.78
  Bottom 0.254: IC4.9 39.08,25.23 v39.37,25.88 | R10.1 53.17,26.8 v53.59,26.8
SHUTDOWN_REQ/
  Bottom 0.203: P2.34 45.13,32.89 5.59,32.89 4.32,31.62 4.32,28.83 2.29,26.8 2.29,26.29 R3.2
SPI_ADC_CNV
  Bottom 0.203: RN1.5 23.81,7.82 24.89,6.73 24.89,4.95 24.38,4.57 12.61,4.57 P1.6
SPI_MISO
  Bottom 0.203: RN1.8 21.22,8.14 20.83,7.75 17.88,7.76 P1.10
SPI_MOSI
  Bottom 0.203: RN1.6 23.01,7.39 22.35,6.73 22.35,5.21 21.97,4.95 19.85,4.95 P1.12
SPI_SCK
  Bottom 0.203: RN1.7 22.21,7.6 21.84,7.24 18.03,7.24 17.4,6.6 17.4,5.33 17.02,4.95 14.9,4.95 P1.8
USB_DM  (via drill 0.38)
  Top 0.254: P1.9 15.9,3.53 14.73,4.7 12.7,4.7 12.19,5.21 12.19,8.25 12.45,8.51 12.45,10.54 11.18,11.81 11.18,15.88 12.45,17.14 14.1,17.14 J5.D- 15.15,17.14 v15.24,17.91
  Bottom 0.254: v15.24,17.91 15.43,17.33 IC6.1 IC6.6
USB_DP  (via drill 0.38)
  Top 0.254: 18.61,3.62 P1.11 17.31,4.83 15.62,4.83 14.86,5.59 14.86,6.99 14.35,7.49 13.97,7.49 12.95,8.51 12.95,10.8 11.68,12.07 11.68,14.35 12.45,15.11 14.1,15.11 J5.D+ 15.15,15.11 v15.24,14.35
  Bottom 0.254: v15.24,14.35 15.17,15.18 IC6.3 IC6.4
USB_VBUS  (via drill 0.38)
  Top 0.406: 10.82,3.53 P1.5 P1.7 | v8.27,16.74 v8.27,16.75 9.03,17.52
  Top 0.61: 10.82,3.53 9.52,4.83 7.62,4.83 7.16,5.33 7.16,15.62 v8.27,16.74 9.03,17.52 11.12,19.63 J5.VBUS
  Bottom 0.406: IC6.5 8.88,16.13 v8.27,16.74
USBGND  (via drill 0.38)
  Top 0.406: 19.05,7.75 19.05,7.49 19.81,6.73 19.81,5.46 20.45,4.83 22.39,4.83 P1.15 | v16.13,12.57 14.17,12.57 J5.GND
  Top 0.762: J5.GND 14.12,9.12 15.49,7.75 19.05,7.75
  Bottom 0.406: IC6.2 15.75,16.13 16.13,15.75 v16.13,12.57
  pour Top: 13.84,9.27 13.84,6.6 15.62,4.83 17.27,4.83 18.54,3.56 23.75,3.56 23.75,5.08 23.37,5.46 21.72,5.46 19.18,8 15.62,8 14.1,9.52
VREF  (via drill 0.38)
  Top 0.254: v25.91,16.4 v28.45,16.38
  Bottom 0.203: J1.1 28.77,24.57 29.59,23.75 29.59,21.59 28.45,20.45 v28.45,16.38
  Bottom 0.254: IC3.2 21.6,15.61 21.28,15.96 20.9,15.96 20.7,16.38 20.7,18.29 21.08,18.67 C3.1 21.69,19.28 22.1,19.68 24.13,19.68 24.38,19.43 24.38,17.65 24.89,17.14 25.15,17.14 v25.91,16.4

### Text on the board
tPlace: D1 | D2 | D3 | D4 | D5 | D6 | D7 | D8 | D9 | D0 | D12 | GND | 3.3V | D10 | D11 | A0 | A1 | 2 | A3 | A4 | A5 | A6 | A7 | GND | REF | R | L | GND | OUT | IN | 3.3V | GND | GND | 5V | D15 | D14 | D13 | bela.io | rev. B4
bPlace: (c) Augmented Instruments Ltd | P2 | P1 | A. McPherson 11/20 | Bela Mini
tNames: SW1 | D5